# Altium schematic sheet Source_VDDM.SchDoc
size A3; SheetNumber: 5; SheetTotal: 8
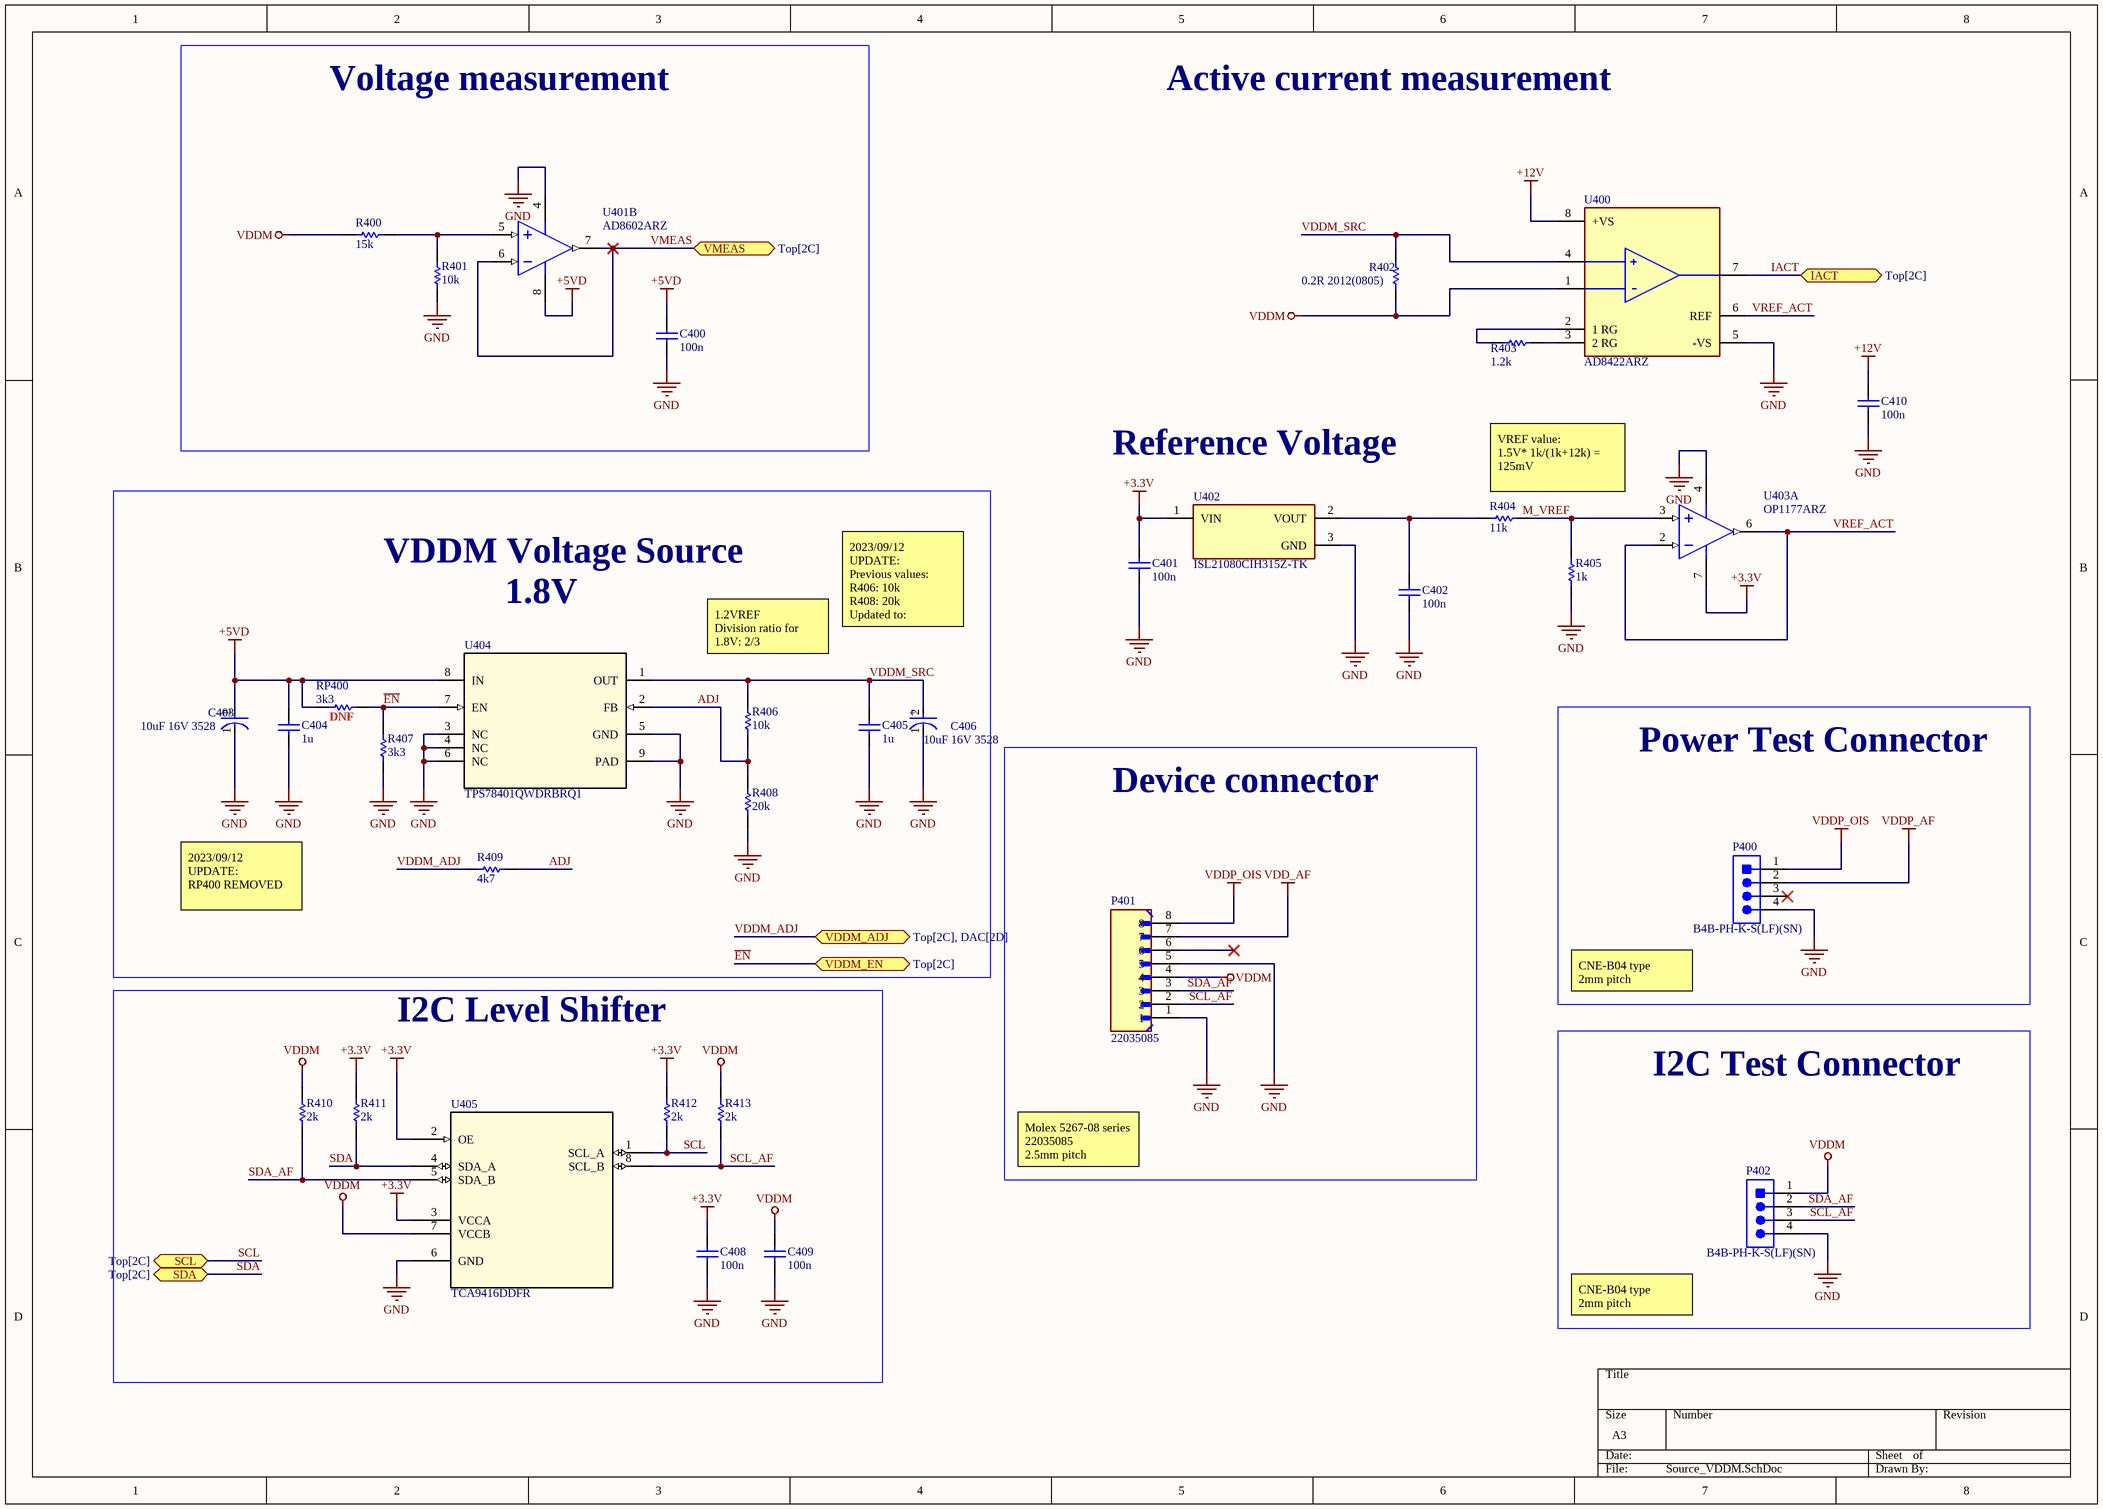
[diagram p0: Source_VDDM.SchDoc]

## Parts
C400  100n  [SAMS-C0603-2_M]
C401  100n  [SAMS-C0603-2_M]
C402  100n  [SAMS-C0603-2_M]
C403  10uF 16V 3528  [FP-T491B106K020AT-MFG]
C404  1u  [CAPC2013X70X45NL10T25]
C405  1u  [CAPC2013X70X45NL10T25]
C406  10uF 16V 3528  [FP-T491B106K020AT-MFG]
C408  100n  [SAMS-C0603-2_M]
C409  100n  [SAMS-C0603-2_M]
C410  100n  [SAMS-C0603-2_M]
P400  B4B-PH-K-S(LF)(SN)  [JST-B4B-PH-K-S_V]
P401  22035085  [MOLEX_22035085]
P402  B4B-PH-K-S(LF)(SN)  [JST-B4B-PH-K-S_V]
R400  15k  [RESC1608X55X30ML15T15]
R401  10k  [RESC1608X55X30ML15T15]
R402  0.2R 2012(0805)  [RESC2013X46X38ML25T25]
R403  1.2k  [RESC1609X55X30ML15T15]
R404  11k  [RESC1608X55X30ML15T15]
R405  1k  [RESC1608X55X30ML15T15]
R406  10k  [RESC1609X55X30ML15T15]
R407  3k3  [RESC1609X55X30ML15T15]
R408  20k  [RESC1609X55X30ML15T15]
R409  4k7  [RESC1608X55X30ML15T15]
R410  2k  [RESC1608X55X30ML15T15]
R411  2k  [RESC1608X55X30ML15T15]
R412  2k  [RESC1608X55X30ML15T15]
R413  2k  [RESC1608X55X30ML15T15]
RP400  3k3  [RESC1609X55X30ML15T15]
U400  AD8422ARZ  [FP-R-8-IPC_A]
U401  AD8602ARZ  [ADI-R-8_N]  (part B of 2)
U402  ISL21080CIH315Z-TK  [FP-P3_064A-IPC_A]
U403  OP1177ARZ  [ADI-R-8_M]  (part A of 2)
U404  TPS78401QWDRBRQ1  [DRB0008J-IPC_A]
U405  TCA9416DDFR  [SOT_16DDFR_TEX]

## Blocks framed on the sheet
Voltage measurement: C400 R400 R401 U401
Power Test Connector: P400
Device connector: P401
I2C Level Shifter: C408 C409 R410-R413 U405
I2C Test Connector: P402

## Ports
IACT (bidir, see Top[2C]), SCL (bidir, see Top[2C]), SDA (bidir, see Top[2C]), VDDM_ADJ (bidir, see Top[2C], DAC[2D]), VDDM_EN (bidir, see Top[2C]), VMEAS (bidir, see Top[2C])

## Nets
+3.3V: C401.2 C408.2 R411.2 R412.2 U402.1(VIN) U403.7(+V) U405.2(OE) U405.3(VCCA)
+5VD: C400.2 C403.2(A) C404.2 RP400.2 U401.8(+V) U404.8(IN)
+12V: C410.2 U400.8(+VS)
GND: C400.1 C401.1 C402.1 C403.1(C) C404.1 C405.1 C406.1(C) C408.1 C409.1 C410.1 P400.4 P401.1 P401.5 P402.4 R401.1 R405.1 R407.1 R408.1 U400.5(-VS) U401.4(-V) U402.3(GND) U403.4(-V) U404.3(NC) U404.4(NC) U404.5(GND) U404.6(NC) U404.9(PAD) U405.6(GND)
VDD_AF: P401.7
VDDM: C409.2 P401.4 P402.1 R400.1 R402.1 R410.2 R413.2 U400.1(-IN) U405.7(VCCB)
VDDP_AF: P400.2
VDDP_OIS: P400.1 P401.8
ADJ: R406.1 R408.2 R409.2 U404.2(FB)
~{EN}: R407.2 RP400.1 U404.7(EN) ; port VDDM_EN
IACT: U400.7(VOUT) ; port IACT
M_VREF: R404.1 R405.2 U403.3(+IN)
SCL: R412.1 U405.1(SCL_A) ; port SCL
SCL_AF: P401.2 P402.3 R413.1 U405.8(SCL_B)
SDA: R411.1 U405.4(SDA_A) ; port SDA
SDA_AF: P401.3 P402.2 R410.1 U405.5(SDA_B)
VDDM_ADJ: R409.1 ; port VDDM_ADJ
VDDM_SRC: C405.2 C406.2(A) R402.2 R406.2 U400.4(+IN) U404.1(OUT)
VMEAS: U401.6(-IN_B) U401.7(OUT_B) ; port VMEAS
VREF_ACT: U400.6(REF) U403.2(-IN) U403.6(OUT)
NetC402_2: C402.2 R404.2 U402.2(VOUT)
NetR400_2: R400.2 R401.2 U401.5(+IN_B)
NetR403_1: R403.1 U400.2(1_RG)
NetR403_2: R403.2 U400.3(2_RG)

Not connected (* = marked no-connect by the designer): P400 3*; P401 6*

## Notes on the sheet
- Active current measurement
- Reference Voltage
- (near R404) VREF value:
  1.5V* 1k/(1k+12k) = 125mV
- VDDM Voltage Source
- 1.8V
- 1.2VREF
  Division ratio for 1.8V: 2/3
- 2023/09/12 UPDATE:
  Previous values:
  R406: 10k
  R408: 20k
  Updated to:
- (near RP400) DNF
- 2023/09/12 UPDATE:
  RP400 REMOVED
- CNE-B04 type
  2mm pitch
- Molex 5267-08 series
  22035085
  2.5mm pitch
- (in symbol CMP-2000-07191-2) +

## Library data of the parts
C400-C402 C408-C410 = CMP-2000-05332-1: Multi-layer Ceramic Capacitor, -55 to 125 degC, 2-Pin SMD (0603), RoHS, Tape and Reel; Manufacturer: Samsung Electro-Mechanics; Capacitance: 0.1µF; Rated Voltage: 50V; Dielectric: X7R; Tolerance (%): ±10%; Case Size/Dimension: 0603; Datasheet URL: https://datasheet.ciiva.com/29198/456651-da-01-en-vs-kondensator-0605-29198839.pdf; Manufacturer URL: http://www.samsungsem.com/global/index.jsp; Datasheet Version: Nov-10
C403 C406 = CMP-2000-07191-2: CAP TANT 10UF 10% 20V 1411; Polarity: Polar; Life (Hours): 2000Hour; Dissipation Factor: 6%; Leakage Current: 2uA; Dielectric Material: Tantalum; Ripple Current: 201mA; ESR (Equivalent Series Resistance): 2.1R; Weight: 0.002293oz; Max Operating Temperature: 125°C; Failure Rate: 0.001%; Tolerance: 10%; Case Code (Metric): 3528; Case Code (Imperial): 1411; Number of Pins: 2; Case/Package: 1411; Width: 2.8mm; Height: 1.9mm; Voltage Rating: 20V; Voltage: 20V; Lead Free: Lead Free; Features: General Purpose; Radiation Hardening: No; Min Operating Temperature: -55°C; Length: 3.5mm; Mount: Surface Mount; Depth: 2.8mm; Voltage Rating (DC): 20V; Termination: SMD/SMT; Package Quantity: 1; Capacitance: 10uF; Packaging: Tape and Reel; RoHS Compliant: Yes; REACH SVHC: No SVHC; Height - Seated (Max): 0.083inch
C404 C405 = CMP-2007-00957-1: Part Number: GRM216R61E105KA12D; Manufacturer: Murata
P400 P402 = CMP-2000-05165-1: Male Header, Pitch 2 mm, 1 x 4 Position, Height 6 mm, Tail Length 3.4 mm, -25 to 85 degC, RoHS, Bulk; Manufacturer: JST; No of Positions: 4; Style/Orientation: StraightHeader/Plug; Pitch: 2mm; Datasheet URL: http://datasheet.octopart.com/B4B-PH-K-S%28LF%29%28SN%29-JST-datasheet-10558886.pdf; Type: ShroudedHeader; Manufacturer URL: http://www.jst.com/home2.html; Termination: Crimp; Datasheet Version: Apr-09
P401 = 22035085: 2.50mm Pitch, Mini-SPOX PCB Header, Single Row, Vertical, Through Hole, Tin Plating, 8 Circuits, Bag, 3.50mm PC Tail Length; Price: None; Availability: Unavailable; Package: None; MP: 22035085; Value: *
R400 = CMP-2000-00460-1: Part Number: ERJ-3EKF3602V; Manufacturer: Panasonic
R401 = CMP-1012-00109-2: Part Number: ERJ-3GEYJ303V; Manufacturer: Panasonic
R402 = CMP-2001-04350-1: Part Number: WSL0805R2000FEA; Manufacturer: Vishay Dale
R403 = CMP-2000-00214-2: Chip Resistor, 1.2 KOhm, +/- 1%, 0.1 W, -55 to 155 degC, 0603 (1608 Metric), RoHS, Tape and Reel; Manufacturer: Panasonic; Max Power Dissipation: 100mW; Voltage Rating (DC): 75V; Temperature Coefficient: 100ppm/degC; Package Description: 2-Pin Surface Mount Device, Body 1.6 x 0.85 mm; Contact Plating: Tin; Number of Pins: 2; Resistance: 1.2KOhm; Length: 1.6mm; Height: 0.022inch; Number of Terminations: 2; Mount: SurfaceMount; Package Reference: 0603; Packaging: TapeandReel; Case Code (Metric): 1608; Datasheet Version: 42095.0; Datasheet URL: https://industrial.panasonic.com/cdbs/www-data/pdf/RDA0000/AOA0000C283.pdf; Depth: 0.8mm; REACH SVHC: NoSVHC; Case/Package: 0603; Min Operating Temperature: -55degC; Composition: ThickFilm; Manufacturer URL: http://www.panasonic.com/; Termination: SMD/SMT; Package Quantity: 1; Case Code (Imperial): 0603; Width: 0.031inch; Power Rating: 100mW; Voltage Rating: 75V; Lead Free: LeadFree; Package URL: http://www.st.com/st-web-ui/static/active/en/resource/technical/document/datasheet/CD00001320.pdf; RoHSCompliant: True; Tolerance: 1%; Military Standard: Not; Max Operating Temperature: 155degC
R404 = CMP-2000-00199-1: Part Number: ERJ-3EKF1102V; Manufacturer: Panasonic
R405 = CMP-2000-00180-1: Part Number: ERJ-3EKF1001V; Manufacturer: Panasonic
R406 R408 = CMP-1012-00623-3: Chip Resistor, 10 KOhm, +/- 1%, 0.1 W, -55 to 155 degC, 0603 (1608 Metric), RoHS, Tape and Reel; Manufacturer: Panasonic; Voltage Rating: 75V; Case\/Package: 0603; Power Rating: 100mW; Resistance: 10KOhm; Temperature Coefficient: 100ppm\/degreesC; Number of Pins: 2; Package Reference: 603; Depth: 0.8mm; Mount: SurfaceMount; Package Description: 2-Pin Surface Mount Device, Body 1.6 x 0.85 mm; Datasheet Version: 02/2017; Length: 1.6mm; Lead Free: LeadFree; Height: 0.45mm; Number of Terminations: 2; Max Power Dissipation: 100mW; Min Operating Temperature: -55degC; Datasheet URL: https://industrial.panasonic.com/cdbs/www-data/pdf/RDA0000/AOA0000C304.pdf; Termination: SMD/SMT; Case Code (Metric): 1608; Case Code (Imperial): 0603; Tolerance: 1%; Max Operating Temperature: 155degC; RoHSCompliant: true; Voltage Rating (DC): 75V; Radiation Hardening: No; Packaging: TapeandReel; Composition: ThickFilm; Mounting Technology: SurfaceMount; Manufacturer URL: http://www.panasonic.com/; Width: 0.031inch; REACH SVHC: NoSVHC; Contact Plating: Tin; Military Standard: Not; Package Quantity: 1
R407 RP400 = CMP-2000-00436-2: Chip Resistors, 3.3 KOhm, +/- 1%, 0.1 W, 0603 (1608 Metric), -55 to 155 degC, RoHS, Tape and Reel; Manufacturer: Panasonic; Max Power Dissipation: 100mW; Voltage Rating: 75V; Temperature Coefficient: 100ppm/degreesC; Datasheet Version: 42095.0; Width: 0.8mm; Mount: SurfaceMount; Radiation Hardening: No; Package URL: http://www.st.com/st-web-ui/static/active/en/resource/technical/document/datasheet/CD00001320.pdf; Depth: 0.8mm; Package Description: 2-Pin Surface Mount Device, Body 1.6 x 0.85 mm; Package Quantity: 1; Contact Plating: Tin; Length: 1.6mm; Max Operating Temperature: 155degC; RoHSCompliant: true; Datasheet URL: https://industrial.panasonic.com/cdbs/www-data/pdf/RDA0000/AOA0000C283.pdf; Height: 0.022inch; Military Standard: Not; Termination: SMD/SMT; Case Code (Metric): 1608; Composition: ThickFilm; Resistance: 3.3KOhm; Packaging: TapeandReel; Min Operating Temperature: -55degC; Case/Package: 0603; Voltage Rating (DC): 75V; Lead Free: LeadFree; Package Reference: 0603; Power Rating: 100mW; Manufacturer URL: http://www.panasonic.com/; Case Code (Imperial): 0603; REACH SVHC: NoSVHC; Number of Terminations: 2; Number of Pins: 2; Tolerance: 1%
R409 = CMP-1012-00586-3: Precision Thick Film Chip Resistor, 4.7 KOhm, +/- 1%, -55 to 155 degC, 0603 (1608 Metric), RoHS, Tape and Reel; Resistance: 220 Ohm; Voltage Rating: 50 V; Elements: 4; Case\Package: 1205; Tolerance: 5%; Power Rating: 250 mW; PackageReference: 0603; Max Operating Temperature: 125 degC; REACH SVHC: No SVHC; Width: 0.063 inch; Length: 0.126 inch; Height: 0.024 inch; Mount: Surface Mount; Package Quantity: 1; DatasheetVersion: Apr-15; ComponentLink1Description: Manufacturer URL; Min Operating Temperature: -55 degC; Packaging: Tape and Reel; Radiation Hardening: No; ComponentLink2URL: http://industrial.panasonic.com/cdbs/www-data/pdf/RDA0000/AOA0000C86.pdf; Case Code (Metric): 3216; Pins: 8; Case Code (Imperial): 1206; Type (Resistor): Thick Film; RoHSCompliant: true; ComponentLink2Description: Datasheet; PackageDescription: 2-Pin Surface Mount Device, Body 1.6 x 0.85 mm; ComponentLink1URL: http://www.panasonic.com/
R410-R413 = CMP-2000-00317-1: Part Number: ERJ-3EKF2001V; Manufacturer: Panasonic
U400 = CMP-09116-000053-1: IC INST AMP 1 CIRCUIT 8SOIC; Number of Amplifiers: 1; Max Supply Current: 1nA; Max Dual Supply Voltage: 18V; Max Supply Voltage: 3.6V; Input Offset Voltage (Vos): 0.3uV; -3db Bandwidth: 2.2MHz; Min Dual Supply Voltage: 1.8V; Output Current per Channel: 20mA; Slew Rate: 0.8V/µs; Input Bias Current: 500pA; Nominal Supply Current: 300uA; Common Mode Rejection Ratio: 94dB; Mount: Surface Mount; Case/Package: SOIC; Radiation Hardening: No; Number of Circuits: 1; Max Operating Temperature: 85°C; Package Quantity: 98; Number of Pins: 8; Lead Free: Contains Lead; REACH SVHC: No SVHC; Number of Channels: 1; Contact Plating: Tin; Packaging: Rail/Tube; Min Operating Temperature: -40°C; Gain Bandwidth Product: 2.2MHz; Bandwidth: 2.2MHz; Min Supply Voltage: 3.6V; Operating Supply Current: 300uA; Length: 5mm; Width: 4mm; Height: 1.5mm
U401 = CMP-0384-00551-1: Double Channel Wide Bandwidth Operational Amplifier, 8.4 MHz BW, 6 V/us SR, Industrial, 8-pin SOIC (R-8), Tube; Generic Part Number: AD8602; Manufacturer: Analog Devices; Input Offset Voltage: 500uV; V Span Min: 2.7V; Small Signal Bandwidth: 8.4MHz; Automotive Qualified: Yes; Input Bias Current: 200fA; Iq/Amp: 1.2mA; Amplifiers Per Package: 2; Slew Rate: 6V/us; V Span Max: 6V; Code_JEDEC: MS-012-AA; ComponentLink2Description: Datasheet; ComponentLink2URL: http://www.analog.com/static/imported-files/data_sheets/AD8601_8602_8604.pdf; ComponentLink3URL: http://www.analog.com/static/imported-files/packages/PKG_PDF/SOIC_Narrow%20(R)/R_8.pdf; ComponentLink1URL: http://www.analog.com/en/index.html; ComponentLink3Description: Package Specification; PartNumber: AD8602ARZ; Mounting Technology: Surface Mount; PackageReference: R-8; PackageDescription: 8-Pin Standard Small Outline Package, Body 3.9 x 4.9 mm, Pitch 1.27 mm; DatasheetVersion: Rev. G; PackageVersion: 060506-A; ComponentLink1Description: Manufacturer URL
U402 = CMP-13559-000003-1: IC VREF SERIES 0.5% SOT23-3; RoHS Compliant: Yes
U403 = CMP-0384-00637-2: Single Channel Wide Bandwidth Operational Amplifier, 1.3 MHz BW, 700 mV/us SR, Industrial, 8-pin SOIC (R-8), Tube; Manufacturer: Analog Devices; Generic Part Number: OP1177; Input Bias Current: 500pA; Amplifiers Per Package: 1; Input Offset Voltage: 15uV; Iq/Amp: 500uA; V Span Max: 36V; V Span Min: 5V; Small Signal Bandwidth: 1.3MHz; Mounting Technology: Surface Mount; Code_JEDEC: MS-012-AA; ComponentLink4Description: Reference Circuit; ComponentLink3Description: Package Specification; PackageVersion: 060506-A; Slew Rate: 700mV/us; RevisionNote: Reference Circuit URL fixed; ComponentLink3URL: http://www.analog.com/static/imported-files/packages/PKG_PDF/SOIC_Narrow%20(R)/R_8.pdf; DatasheetVersion: Rev. G; PartNumber: OP1177ARZ; ComponentLink1URL: http://www.analog.com/en/index.html; ComponentLink1Description: Manufacturer URL; ComponentLink2URL: http://www.analog.com/static/imported-files/data_sheets/OP1177_2177_4177.pdf; PackageReference: R-8; ComponentLink4URL: http://www.analog.com/en/all-operational-amplifiers-op-amps/operational-amplifiers-op-amps/op1177/products/product.html#product-recommendations; ComponentLink2Description: Datasheet; PackageDescription: 8-Pin Standard Small Outline Package, Body 3.9 x 4.9 mm, Pitch 1.27 mm
U404 = TPS78401QWDRBRQ1: No Description Available; Mfr_Name: Texas Instruments; Type: DEV; RefDes: RefDes; Copyright: Copyright (C) 2022 Ultra Librarian. All rights reserved.; Manufacturer_Part_Number: TPS78401QWDRBRQ1
U405 = TCA9416DDFR: No Description Available; Mfr_Name: Texas Instruments; Copyright: Copyright (C) 2022 Ultra Librarian. All rights reserved.; Manufacturer_Part_Number: TCA9416DDFR; RefDes: RefDes; Type: DEV